# EAGLE design as_wounds (EAGLE 9.6.2)
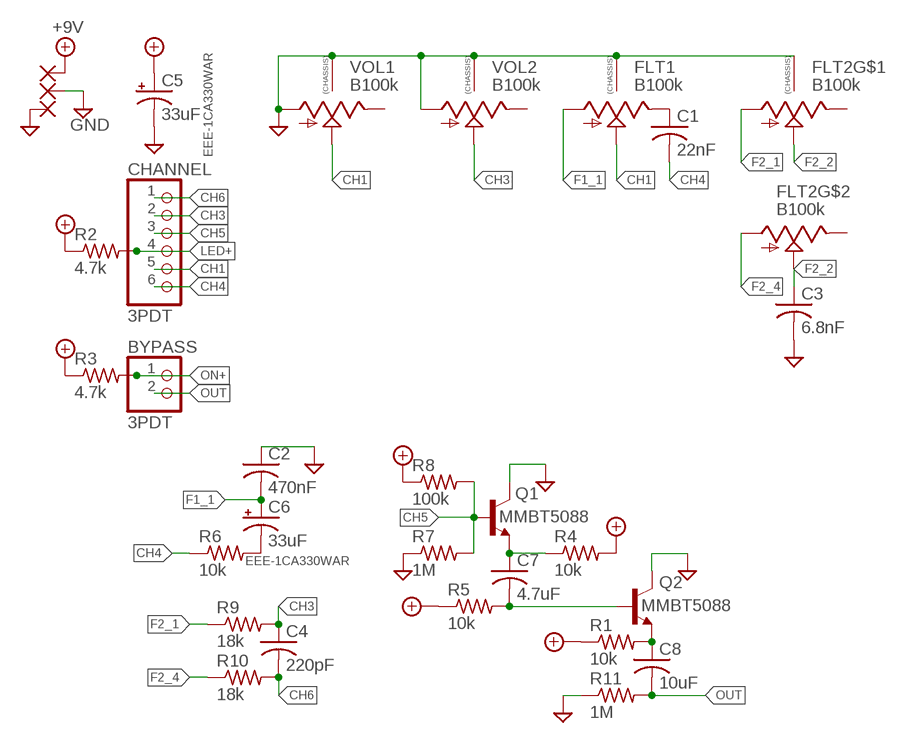
[diagram p0: schematic, sheet 1]

## Parts
BYPASS  3PDT  PINHD-1X2  [1X02]
C1  22nF  C-USC0603  [C0603]
C2  470nF  C-USC0603  [C0603]
C3  6.8nF  C-USC0603  [C0603]
C4  220pF  C-USC0603  [C0603]
C5  33uF  22UF-POLAR-PANASONIC_C-35V-20%  [PANASONIC_C]
C6  33uF  22UF-POLAR-PANASONIC_C-35V-20%  [PANASONIC_C]
C7  4.7uF  C-USC1206  [C1206]
C8  10uF  C-USC1206  [C1206]
CHANNEL  3PDT  PINHD-1X6  [1X06]
FLT1  B100k  9MM_SNAP-IN_POT_CHASSIS  [9MM_SNAP-IN_POT]
FLT2  B100k  ALPHA-9MM-DUALPOT  [DUAL_9MM_SNAP-IN_POT]
PAD1  1,6/0,8  [1,6/0,8]
PAD2  1,6/0,8  [1,6/0,8]
PAD3  1,6/0,8  [1,6/0,8]
Q1  MMBT5088  [SOT23-BEC]
Q2  MMBT5088  [SOT23-BEC]
R1  10k  R-US_R0603  [R0603]
R2  4.7k  R-US_R0603  [R0603]
R3  4.7k  R-US_R0603  [R0603]
R4  10k  R-US_R0603  [R0603]
R5  10k  R-US_R0603  [R0603]
R6  10k  R-US_R0603  [R0603]
R7  1M  R-US_R0603  [R0603]
R8  100k  R-US_R0603  [R0603]
R9  18k  R-US_R0603  [R0603]
R10  18k  R-US_R0603  [R0603]
R11  1M  R-US_R0603  [R0603]
VOL1  B100k  9MM_SNAP-IN_POT_CHASSIS  [9MM_SNAP-IN_POT]
VOL2  B100k  9MM_SNAP-IN_POT_CHASSIS  [9MM_SNAP-IN_POT]

## Nets
+9V: C5.+ PAD1.1(P) R1.1 R2.1 R3.1 R4.2 R5.1 R8.1
CH1: CHANNEL.5 FLT1.2(S) VOL1.2(S)
CH3: C4.1 CHANNEL.2 R9.2 VOL2.2(S)
CH4: C1.2 CHANNEL.6 R6.1
CH5: CHANNEL.3 Q1.B R7.2 R8.2
CH6: C4.2 CHANNEL.1 R10.2
F1_1: C2.2 C6.+ FLT1.1(A)
F2_1: FLT2.1(A) R9.1
F2_2: C3.1 FLT2.2(S) FLT2.2B(S)
F2_4: FLT2.1B(A) R10.1
GND: C2.1 C3.2 C5.- FLT1.CHASSIS1 FLT1.CHASSIS2 FLT2.CHASSIS1 FLT2.CHASSIS2 PAD2.1(P) PAD3.1(P) Q1.C Q2.C R7.1 R11.1 VOL1.1(A) VOL1.CHASSIS1 VOL1.CHASSIS2 VOL2.1(A) VOL2.CHASSIS1 VOL2.CHASSIS2
LED+: CHANNEL.4 R2.2
N$1: C6.- R6.2
N$2: C1.1 FLT1.3(E)
N$3: C7.1 Q1.E R4.1
N$4: C7.2 Q2.B R5.2
N$5: C8.1 Q2.E R1.2
ON+: BYPASS.1 R3.2
OUT: BYPASS.2 C8.2 R11.2
Unconnected: FLT2.3(E) FLT2.3B(E) VOL1.3(E) VOL2.3(E)

## Library data of the parts
BYPASS = pinhead:PINHD-1X2: PIN HEADER
C1-C4 C7 C8 = adafruit:C-US: CAPACITOR, American symbol
C5 C6 = SparkFun-Capacitors:22UF-POLAR: 22µF polarized capacitors A capacitor is a passive two-terminal electrical component used to store electrical energy temporarily in an electric field.; PROD_ID: CAP-08618; VALUE: 22uF
CHANNEL = pinhead:PINHD-1X6: PIN HEADER
FLT1 VOL1 VOL2 = MusicThingModular:9MM_SNAP-IN_POT_CHASSIS: 9mm vertical snap-in pot, Alpha / Panasonic style, with a connection to the metal chassis for grounding
FLT2 = MusicThingModular:ALPHA-9MM-DUALPOT: 9mm vertical snap-in pot, Alpha / Panasonic style, with a connection to the metal chassis for grounding
PAD1-PAD3 = wirepad:1,6/0,8: THROUGH-HOLE PAD
Q1 Q2 = MMBT5088_:MMBT5088*: NPN TRANSISTOR Check prices <https://pricing.snapeda.com/search/part/MMBT5088/?ref=eda>; AVAILABILITY: Good; DESCRIPTION: Bipolar (BJT) Transistor NPN 30V 100mA 50MHz 350mW Surface Mount SOT-23; MF: ON Semiconductor; MP: MMBT5088; PACKAGE: SOT-23-3 Fairchild Semiconductor; PRICE: None; PURCHASE-URL: https://pricing.snapeda.com/search/part/MMBT5088/?ref=eda
R1-R11 = adafruit:R-US_: RESISTOR, American symbol

## Board
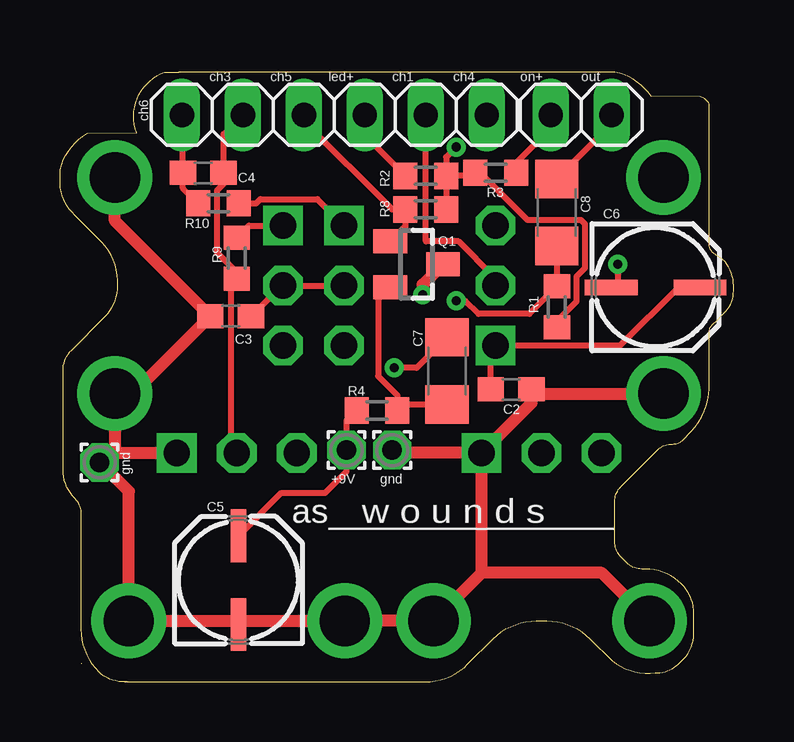
[diagram p1: board, top side]
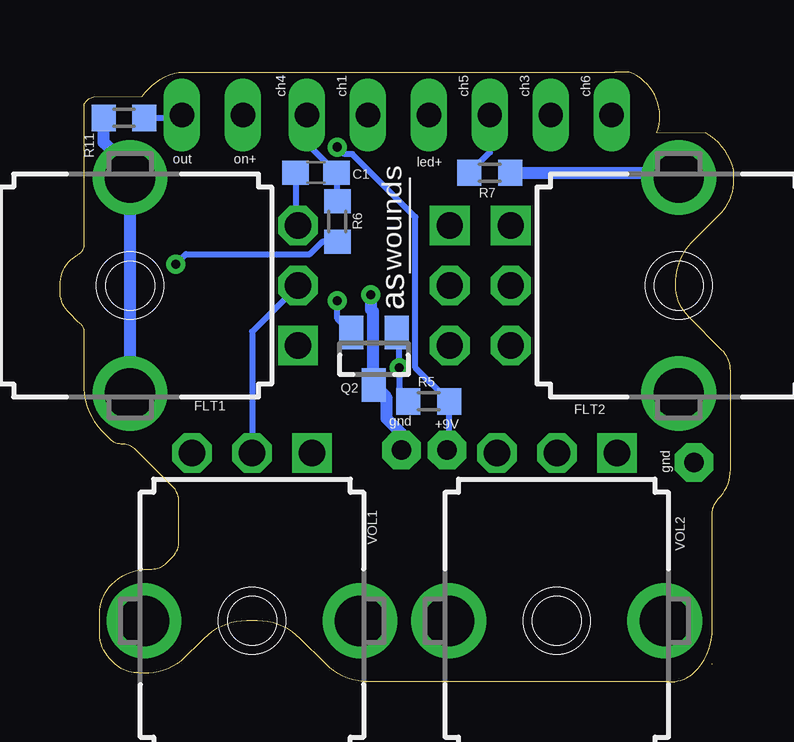
[diagram p2: board, bottom side, seen from below]

Size 28.07 x 25.4 mm. Coordinates in mm from the lower left corner, seen from the top.
Outline: 26.31,10.43 arc45 27.05,12.48
Outline: 2.7,0 15.2,0 arc45 17,0.74 18.05,1.8 arc-45 19.85,2.54 20.28,2.54 arc-45 22.08,1.8 23,0.87 arc45 24.8,0.38 24.89,0.38 arc45 25.76,0.74 25.78,0.76 arc45 26.42,1.86 26.42,2.84 arc45 25.91,4.06 25.9,4.07 arc45 24.38,4.7 24.23,4.7 arc-45 23.62,4.95 23.38,5.19 arc-45 23.11,5.84 23.11,7.52 arc-45 23.37,8.13 24.89,9.65 arc-45 25.5,9.91 25.53,9.91 arc45 25.96,10.09 26.31,10.43
Outline: 26.31,10.43 arc45 27.05,12.48
Outline: 27.05,12.48 27.05,14.63 arc-45 27.3,14.99 27.69,15.37 arc45 28.07,16.29 28.07,16.51 arc45 27.62,17.59 27.18,17.91 arc-45 27.05,18.21 27.05,24.08 arc45 26.67,24.38 24.63,24.39 arc45 23.11,25.4 4.95,25.4 4.35,25.4 arc90 3.19,22.88 1.14,22.85 arc45 0,21.34 0,20.74 arc45 0.62,19.45 1.75,18.32 arc-45 2.41,16.51 arc-45 1.87,15.21 0.49,13.82 arc45 0.13,12.95 0.13,8.85 arc45 0.64,7.62 arc-45 0.89,7.01 0.89,2.2 arc45 1.63,0.4 1.65,0.38 arc45 2.7,0 2.79,0
Outline: 0.91,0.74 0.89,0.76
Copper layers (1*16): Top 0.035mm / dielectric 1.5mm / Bottom 0.035mm
Design rules "default *": minimum track width 6mil, minimum drill 0.35mm, track to track 6mil, track to pad 6mil, pad to pad 6mil, via to via 6mil, smd to smd 6mil, copper to edge 10mil, drill to drill 6mil, minimum pad ring 10mil, minimum via ring 8mil, stop-mask expansion 4mil, vias tented up to drill 0mil, thermal gap 10mil

### Footprints (pad centres in the part's own frame; a part is rotated, then mirrored left to right if it is on the bottom)
1X02 = drill 1.016 long: 1 -1.27,0; 2 1.27,0
C0603 = smd 1.1 x 1: 1 -0.85,0; 2 0.85,0
PANASONIC_C = smd 2.2 x 0.65: + 1.9,-0.2; - -1.8,-0.2
C1206 = smd 1.6 x 1.8: 1 -1.4,0; 2 1.4,0
1X06 = drill 1.016 long: 1 -6.35,0; 2 -3.81,0; 3 -1.27,0; 4 1.27,0; 5 3.81,0; 6 6.35,0
9MM_SNAP-IN_POT = drill 1.1 square: 1 -2.5,-7 | drill 1.1 octagon: 2 0,-7; 3 2.5,-7 | drill 2.1 pad 2.794: CHASSIS1 -4.5,0; CHASSIS2 4.5,0
DUAL_9MM_SNAP-IN_POT = drill 1.1 square: 1 -2.5,-7; 1B -2.5,-9.54 | drill 1.1 octagon: 2 0,-7; 2B 0,-9.54; 3 2.5,-7; 3B 2.5,-9.54 | drill 2.1 pad 2.54: CHASSIS1 -4.5,0; CHASSIS2 4.5,0
1,6/0,8 = drill 0.813 pad 1.6 octagon: 1 0,0
SOT23-BEC = smd 1 x 1.4: B -0.95,-1.1; C 0,1.1; E 0.95,-1.1
R0603 = smd 1 x 1.1: 1 -0.85,0; 2 0.85,0

### Placement (x,y rotation side)
BYPASS  21.72,23.62 0 top
C1  17.4,21.21 0 bottom
C2  18.8,12.19 180 top
C3  7.11,15.24 180 top
C4  5.97,21.21 180 top
C5  7.24,4.19 90 top
C6  24.76,16.64 0 top
C7  16.13,12.95 90 top
C8  20.7,19.56 90 top
CHANNEL  11.43,23.62 0 top
FLT1  25.15,16.51 90 bottom
FLT2  2.29,16.51 270 bottom
PAD1  11.94,9.65 0 top
PAD2  13.84,9.65 0 top
PAD3  1.65,9.14 0 top
Q1  14.86,17.4 270 top
Q2  14.99,13.46 180 bottom
R1  20.7,15.62 90 top
R2  15.24,21.08 180 top
R3  18.16,21.21 0 top
R4  13.21,11.3 180 top
R5  12.7,11.68 180 bottom
R6  16.51,19.18 270 bottom
R7  10.16,21.21 180 bottom
R8  15.24,19.69 180 top
R9  7.37,17.65 270 top
R10  6.6,19.94 180 top
R11  25.4,23.5 0 bottom
VOL1  20.07,2.54 180 bottom
VOL2  7.37,2.54 180 bottom

### Tracks (layer width: path | path; a pad name or v marks a point on that pad's centre or on a via)
+9V  (via drill 0.38)
  Top 0.254: C5.+ 9.22,7.87 11.05,7.87 11.94,8.76 PAD1.1 11.94,10.88 R4.2 | R1.1 20.7,15.03 21.53,15.86 21.53,16.89 21.88,17.24 21.88,19.07 21.72,19.24 19.48,19.24 17.51,21.21 R3.1 17.18,21.08 R2.1 | R2.1 R8.1 | v16.51,22.28 16.09,21.86 R2.1
  Bottom 0.254: PAD1.1 11.85,9.74 R5.1 13.26,13.09 13.26,19.36 15.88,21.99 16.22,21.99 v16.51,22.28
CH1
  Top 0.254: FLT1.2 18.15,16.64 18.08,16.7 18.08,16.87 16.61,18.35 15.24,18.35 CHANNEL.5
  Bottom 0.254: FLT1.2 20.07,14.59 VOL1.2
CH3
  Top 0.254: CHANNEL.2 6.82,22.82 C4.1 6.82,20.75 6.54,20.47 6.54,17.89 7.37,17.06 R9.2 7.11,16.55 7.11,9.79 VOL2.2
CH4
  Bottom 0.254: R6.1 16.51,21.17 C1.2 17.78,22.44 CHANNEL.6
CH5
  Top 0.254: Q1.B 14.39,18.98 R8.2 13.83,19.69 10.16,23.36 CHANNEL.3
  Bottom 0.254: R7.2 10.16,22.06 CHANNEL.3
CH6
  Top 0.254: R10.2 5.12,20.57 C4.2 5.12,23.58 CHANNEL.1
F1_1
  Top 0.254: C2.2 17.95,13.81 FLT1.1 18.16,13.99 23.33,13.99 25.78,16.44 C6.+
F2_1
  Top 0.254: R9.1 7.87,19.01 FLT2.1
F2_2
  Top 0.254: FLT2.2B FLT2.2 9.23,16.51 C3.1
F2_4
  Top 0.254: R10.1 8.17,19.94 8.35,20.11 10.72,20.11 FLT2.1B
GND  (via drill 0.38)
  Top 0.508: FLT2.CHASSIS1 2.29,19.22 C3.2 3.03,12.01 FLT2.CHASSIS2 2.29,9.78 PAD3.1 | PAD3.1 2.05,9.54 VOL2.1 | PAD3.1 2.87,7.93 VOL2.CHASSIS1 7.29,2.54 C5.- 7.59,2.54 VOL2.CHASSIS2 VOL1.CHASSIS1 17.57,4.54 | 17.57,4.54 VOL1.1 | VOL1.1 13.96,9.54 PAD2.1 | VOL1.CHASSIS2 22.57,4.54 17.57,4.54 | VOL1.1 19.65,11.62 C2.1 19.83,12.01 FLT1.CHASSIS1 | Q1.C 15.11,16.55 v15.11,16.13
  Bottom 0.508: R7.1 2.48,21.21 FLT2.CHASSIS1 | PAD2.1 13.84,10.35 14.46,10.97 14.46,11.43 14.46,11.83 Q2.C 15.03,12.41 15.03,15.43 15.11,15.51 v15.11,16.13 | FLT1.CHASSIS1 FLT1.CHASSIS2 25.15,21.38 26.25,22.48 R11.1
LED+
  Top 0.254: R2.2 12.7,22.77 CHANNEL.4
N$1  (via drill 0.38)
  Top 0.254: v23.24,17.4 23.24,16.71 C6.-
  Bottom 0.254: R6.2 17.14,18.33 17.65,17.82 22.82,17.82 v23.24,17.4
N$2
  Bottom 0.254: C1.1 18.25,19.11 FLT1.3
N$3
  Top 0.254: C7.1 14.31,11.55 R4.1 14.06,11.94 13.26,12.74 13.26,15.95 Q1.E
N$4  (via drill 0.38)
  Top 0.254: C7.2 14.86,13.08 v13.93,13.08
  Bottom 0.254: R5.2 13.93,12.07 v13.93,13.08 13.93,14.46 Q2.B
N$5  (via drill 0.38)
  Top 0.254: C8.1 R1.2 19.56,15.33 17.44,15.33 16.89,15.88 v16.51,15.88
  Bottom 0.254: v16.51,15.88 16.51,15.14 Q2.E
ON+
  Top 0.254: R3.2 19.01,21.62 20.45,23.05 BYPASS.1
OUT
  Top 0.254: C8.2 22.99,23.24 BYPASS.2
  Bottom 0.254: R11.2 23.11,23.5 BYPASS.2

### Text on the board
tPlace: ch3 | ch5 | led+ | ch1 | ch4 | on+ | out | ch6 | gnd | +9V | gnd | as_______________ | w o u n d s
bPlace: ch6 | ch3 | ch5 | ch1 | ch4 | on+ | out | led+ | wounds | as_____ | +9V | gnd | gnd